# Altium schematic sheet Power.SchDoc: Eval Board - Power supply
size A3; Author: O. Guinnard; Organization: imperix Ltd; Address1: Rue de l'Industrie 10; Address2: 1950 Sion; Address3: Switzerland; Address4: +41 27 552 06 60; DocumentNumber: 1; SheetNumber: 1; SheetTotal: 7
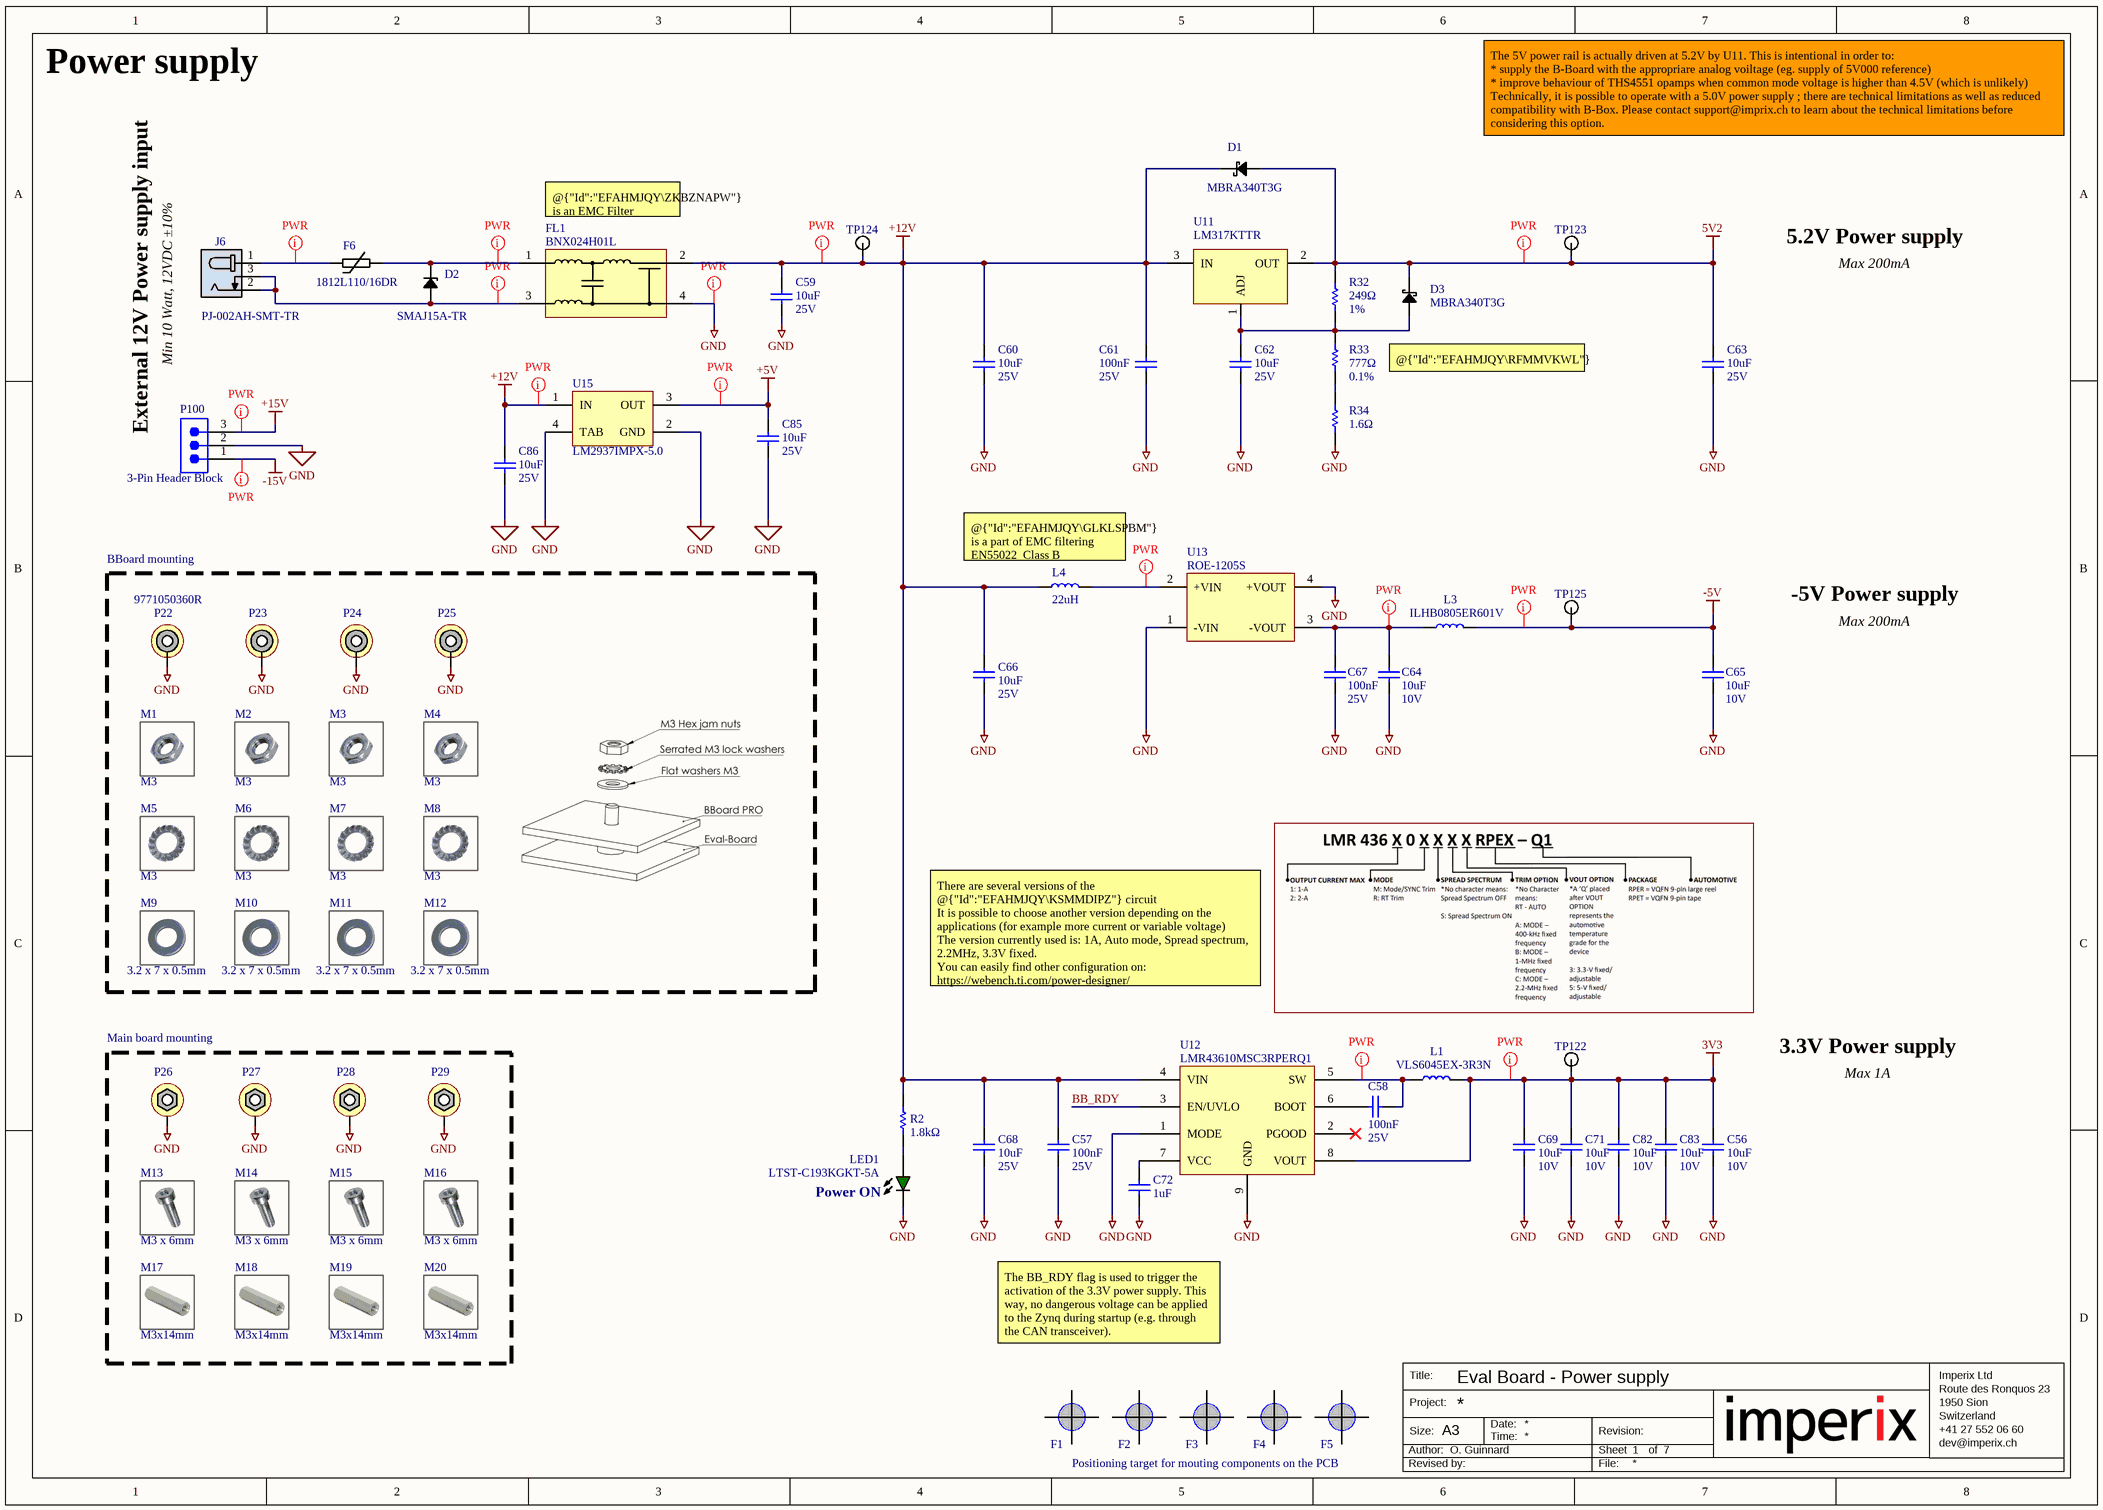
[diagram p0: Power.SchDoc]

## Parts
C56  value 10uF  Voltage Rating (DC): 10V  [CAPC1608L(0603)]  (hidden comment: CAP-10UF-10V-X5R-0603-10%)
C57  value 100nF  Voltage Rating (DC): 25V  [CAPC1005L(0402)]  (hidden comment: CAP-100NF-25V-X7R-0402-10%)
C58  value 100nF  Voltage Rating (DC): 25V  [CAPC1005L(0402)]  (hidden comment: CAP-100NF-25V-X7R-0402-10%)
C59  value 10uF  Voltage Rating (DC): 25V  [CAPC3216L(1206)]  (hidden comment: CAP-10UF-25V-X5R-1206-10%)
C60  value 10uF  Voltage Rating (DC): 25V  [CAPC3216L(1206)]  (hidden comment: CAP-10UF-25V-X5R-1206-10%)
C61  value 100nF  Voltage Rating (DC): 25V  [CAPC1005L(0402)]  (hidden comment: CAP-100NF-25V-X7R-0402-10%)
C62  value 10uF  Voltage Rating (DC): 25V  [CAPC3216L(1206)]  (hidden comment: CAP-10UF-25V-X5R-1206-10%)
C63  value 10uF  Voltage Rating (DC): 25V  [CAPC3216L(1206)]  (hidden comment: CAP-10UF-25V-X5R-1206-10%)
C64  value 10uF  Voltage Rating (DC): 10V  [CAPC1608L(0603)]  (hidden comment: CAP-10UF-10V-X5R-0603-10%)
C65  value 10uF  Voltage Rating (DC): 10V  [CAPC1608L(0603)]  (hidden comment: CAP-10UF-10V-X5R-0603-10%)
C66  value 10uF  Voltage Rating (DC): 25V  [CAPC3216L(1206)]  (hidden comment: CAP-10UF-25V-X5R-1206-10%)
C67  value 100nF  Voltage Rating (DC): 25V  [CAPC1005L(0402)]  (hidden comment: CAP-100NF-25V-X7R-0402-10%)
C68  value 10uF  Voltage Rating (DC): 25V  [CAPC3216L(1206)]  (hidden comment: CAP-10UF-25V-X5R-1206-10%)
C69  value 10uF  Voltage Rating (DC): 10V  [CAPC1608L(0603)]  (hidden comment: CAP-10UF-10V-X5R-0603-10%)
C71  value 10uF  Voltage Rating (DC): 10V  [CAPC1608L(0603)]  (hidden comment: CAP-10UF-10V-X5R-0603-10%)
C72  value 1uF  [CAPC1005L(0402)]  (hidden comment: CAP-1UF-6.3V-X5R-0402-5%)
C82  value 10uF  Voltage Rating (DC): 10V  [CAPC1608L(0603)]  (hidden comment: CAP-10UF-10V-X5R-0603-10%)
C83  value 10uF  Voltage Rating (DC): 10V  [CAPC1608L(0603)]  (hidden comment: CAP-10UF-10V-X5R-0603-10%)
C85  value 10uF  Voltage Rating (DC): 25V  [CAPC3216L(1206)]  (hidden comment: CAP-10UF-25V-X5R-1206-10%)
C86  value 10uF  Voltage Rating (DC): 25V  [CAPC3216L(1206)]  (hidden comment: CAP-10UF-25V-X5R-1206-10%)
D1  MBRA340T3G  [DO-214AC]
D2  SMAJ15A-TR  [DO-214AC]
D3  MBRA340T3G  [DO-214AC]
F1  Fiducial  [Fiducial050]  (value not drawn)  (no BOM)
F2  Fiducial  [Fiducial050]  (value not drawn)  (no BOM)
F3  Fiducial  [Fiducial050]  (value not drawn)  (no BOM)
F4  Fiducial  [Fiducial050]  (value not drawn)  (no BOM)
F5  Fiducial  [Fiducial050]  (value not drawn)  (no BOM)
F6  1812L110/16DR  [PTC Fuse(1812)]
FL1  BNX024H01L  [FP-BNX02-MFG]
J6  PJ-002AH-SMT-TR  [PJ-002AH-SMT-TR]
L1  VLS6045EX-3R3N  [VLS6045EX]
L3  ILHB0805ER601V  [RESC2012L(0805)]
L4  value 22uH  [Inductor 8400 Serie]  (hidden comment: 84223C)
LED1  LTST-C193KGKT-5A  [LED0603_GREEN]
M1  value M3  (hidden comment: 1090615)  (mechanical)
M2  value M3  (hidden comment: 1090615)  (mechanical)
M3  value M3  (hidden comment: 1090615)  (mechanical)
M4  value M3  (hidden comment: 1090615)  (mechanical)
M5  value M3  (hidden comment: 1278037)  (mechanical)
M6  value M3  (hidden comment: 1278037)  (mechanical)
M7  value M3  (hidden comment: 1278037)  (mechanical)
M8  value M3  (hidden comment: 1278037)  (mechanical)
M9  value 3.2 x 7 x 0.5mm  (hidden comment: 1887467)  (mechanical)
M10  value 3.2 x 7 x 0.5mm  (hidden comment: 1887467)  (mechanical)
M11  value 3.2 x 7 x 0.5mm  (hidden comment: 1887467)  (mechanical)
M12  value 3.2 x 7 x 0.5mm  (hidden comment: 1887467)  (mechanical)
M13  value M3 x 6mm  (hidden comment: 1145924)  (mechanical)
M14  value M3 x 6mm  (hidden comment: 1145924)  (mechanical)
M15  value M3 x 6mm  (hidden comment: 1145924)  (mechanical)
M16  value M3 x 6mm  (hidden comment: 1145924)  (mechanical)
M17  value M3x14mm  (hidden comment: 1382748)  (mechanical)
M18  value M3x14mm  (hidden comment: 1382748)  (mechanical)
M19  value M3x14mm  (hidden comment: 1382748)  (mechanical)
M20  value M3x14mm  (hidden comment: 1382748)  (mechanical)
P22  9771050360R  [9771050360R]
P23  9771050360R  [9771050360R]  (value not drawn)
P24  9771050360R  [9771050360R]  (value not drawn)
P25  9771050360R  [9771050360R]  (value not drawn)
P26  Spacer M3 connected  [Spacer M3 connected]  (value not drawn)  (no BOM)
P27  Spacer M3 connected  [Spacer M3 connected]  (value not drawn)  (no BOM)
P28  Spacer M3 connected  [Spacer M3 connected]  (value not drawn)  (no BOM)
P29  Spacer M3 connected  [Spacer M3 connected]  (value not drawn)  (no BOM)
P100  3-Pin Header Block  [691322310003]
R2  value 1.8kΩ  [RESC1608L(0603)]  (hidden comment: RES-1.8KΩ-1/8W-25PPM-0603-0.1%)
R32  value 249Ω  Tolerance: 1%  [RESC1005L(0402)]  (hidden comment: RES-249Ω-1/16W-100PPM-0402-1%)
R33  value 777Ω  Tolerance: 0.1%  [RESC1005L(0402)]  (hidden comment: RES-777Ω-1/16W-25PPM-0402-0.1%)
R34  value 1.6Ω  [RESC1005L(0402)]  (hidden comment: RES-1.6Ω-1/16WW-200PPM-0402-5%)
TP122  5001  [5001]  (value not drawn)
TP123  5001  [5001]  (value not drawn)
TP124  5001  [5001]  (value not drawn)
TP125  5001  [5001]  (value not drawn)
U11  LM317KTTR  [TO263-3]
U12  LMR43610MSC3RPERQ1  [LMR43610MSC3RPERQ1]
U13  ROE-1205S  [ROE]
U15  LM2937IMPX-5.0  [MP04A_M]

## Blocks framed on the sheet
BBoard mounting: M1-M12 P22-P25
Main board mounting: M13-M20 P26-P29

## Nets
3V3: C56.2 C69.2 C71.2 C82.2 C83.2 L1.2 TP122.1(TP) U12.8(VOUT)
5V2: C63.2 D1.A D3.K R32.2 TP123.1(TP) U11.2(OUT)
+5V: C85.2 U15.3(OUT)
+12V: C57.2 C59.2 C60.2 C61.2 C66.2 C68.2 C86.2 D1.K FL1.2(CB) L4.1 R2.2 TP124.1(TP) U11.3(IN) U12.4(VIN) U15.1(IN)
+15V: P100.3
-5V: C65.1 L3.2 TP125.1(TP)
-15V: P100.1
GND: C56.1 C57.1 C59.1 C60.1 C61.1 C62.1 C63.1 C64.2 C65.2 C66.1 C67.2 C68.1 C69.1 C71.1 C72.1 C82.1 C83.1 C85.1 C86.1 FL1.4(CG) LED1.K P22.0 P23.0 P24.0 P25.0 P26.1 P27.1 P28.1 P29.1 P100.2 R34.1 U12.1(MODE) U12.9(GND) U13.1(-VIN) U13.4(+VOUT) U15.2(GND) U15.4(TAB)
BB_RDY: U12.3(EN/UVLO)
NetC58_1: C58.1 L1.1 U12.5(SW)
NetC58_2: C58.2 U12.6(BOOT)
NetC62_2: C62.2 D3.A R32.1 R33.2 U11.1(ADJ)
NetC64_1: C64.1 C67.1 L3.1 U13.3(-VOUT)
NetC72_2: C72.2 U12.7(VCC)
NetD2_A: D2.A FL1.3(PSG) J6.2 J6.3
NetD2_K: D2.K F6.2 FL1.1(B)
NetF6_1: F6.1 J6.1
NetL4_2: L4.2 U13.2(+VIN)
NetLED1_A: LED1.A R2.1
NetR33_1: R33.1 R34.2

Not connected (* = marked no-connect by the designer): U12 2(PGOOD)*

## Layout directives
net class PWR: 3V3, 5V2, +5V, +12V, +15V, -5V, -15V, GND, NetC58_1, NetC64_1, NetD2_A, NetD2_K, NetF6_1, NetL4_2

## Notes on the sheet
- Power supply
- The 5V power rail is actually driven at 5.2V by U11. This is intentional in order to:
  * supply the B-Board with the appropriare analog voiltage (eg. supply of 5V000 reference)
  * improve behaviour of THS4551 opamps when common mode voltage is higher than 4.5V (which is unlikely)
  Technically, it is possible to operate with a 5.0V power supply ; there are technical limitations as well as reduced compatibility with B-Box. Please contact support@imprix.ch to learn about the technical limitations before considering this option.
- (near FL1) @{"Id":"EFAHMJQY\ZKBZNAPW"} is an EMC Filter
- 5.2V Power supply
- External 12V Power supply input
- Min 10 Watt, 12VDC ±10%
- Max 200mA
- @{"Id":"EFAHMJQY\RFMMVKWL"} helps reduce the noise of @{"Id":"EFAHMJQY\SLPSMMLY"}
- (near L4) @{"Id":"EFAHMJQY\GLKLSPBM"} is a part of EMC filtering
  EN55022  Class B
- -5V Power supply
- There are several versions of the @{"Id":"EFAHMJQY\KSMMDIPZ"} circuit
  It is possible to choose another version depending on the applications (for example more current or variable voltage)
  The version currently used is: 1A, Auto mode, Spread spectrum, 2.2MHz, 3.3V fixed.
  You can easily find other configuration on: https://webench.ti.com/power-designer/
- 3.3V Power supply
- Max 1A
- (near LED1) Power ON
- The BB_RDY flag is used to trigger the activation of the 3.3V power supply. This way, no dangerous voltage can be applied to the Zynq during startup (e.g. through the CAN transceiver).
- Positioning target for mouting components on the PCB
- Title:
- Imperix Ltd
- Route des Ronquos 23
- Author:
- Project:
- Size:
- A3
- Date:
- Time:
- Revision:
- Sheet
- of
- 1950 Sion
- Switzerland
- +41 27 552 06 60
- dev@imperix.ch
- Revised by:
- File:

## Library data of the parts
C56 C64 C65 C69 C71 C82 C83 = CMP-055-000003-7: CAP CER 10UF 10V X5R 0603 10% (Generic Imperix Component); Tolerance: 10%; Dielectric: X5R; Case/Package: 0603
C57 C58 C61 C67 = CMP-004-000006-18: CAP CER 100NF 25V X7R 0402 10% (Generic Imperix Component); Tolerance: 10%; Case/Package: 0402; Dielectric: X7R
C59 C60 C62 C63 C66 C68 C85 C86 = CMP-002-000022-5: CAP CER 10UF 25V X5R 1206 10% (Generic Imperix Component); Tolerance: 10%; Dielectric: X5R; Case/Package: 1206
  C86: Manufacturer: *
C72 = CMP-004-000008-13: CAP CER 1UF 6.3V X5R 0402 5% (Generic Imperix Component); Tolerance: 5%; Case/Package: 0402; Dielectric: X5R; Voltage Rating (DC): 6.3V
D1 D3 = CMP-005-000028-6: Diode Schottky 40 V 3A Surface Mount SMA; Max Forward Surge Current (Ifsm): 100A; Max Repetitive Reverse Voltage (Vrrm): 40V; Polarity: Standard; Element Configuration: Single; Forward Voltage: 450mV; Max Reverse Current: 300uA; Max Operating Temperature: 150°C; Radiation Hardening: No; Length: 4.32mm; Reach SVHC Compliant: No; Pins: 2; Package Quantity: 1; Voltage Rating (DC): 40V; RoHS Compliant: Yes; Halogen Free: Halogen Free; Series: -; Current Rating: 3A; Case/Package: DO-214AC; Height: 2mm; Min Operating Temperature: -55°C; Lead Free: Lead Free; Peak Non-Repetitive Surge Current: 100A; Max Reverse Voltage (DC): 40V; Output Current: 3A; Width: 2.6mm; Packaging: Tape and Reel; Forward Current: 3A; Average Rectified Current: 3A
D2 = CMP-030-000001-20: 32.5V Clamp 71A (8/20µs) Ipp Tvs Diode Surface Mount SMA (DO-214AC) Unidirectional; Voltage Rating (DC): 15V; Leakage Current: 200nA; Max Breakdown Voltage: 17.6V; Value: 975pF; Min Breakdown Voltage: 16.7V; Number of Elements: 1; Diode Type: ZENER; Power Line Protection: No; Power Dissipation: 400W; ESD Protection: Yes; Test Current: 1mA; Min Operating Temperature: -55°C; Height: 2.03mm; Max Reverse Leakage Current: 200nA; Breakdown Voltage: 17.6V; Max Operating Temperature: 150°C; Clamping Voltage-Max: 32.5V; Lead Free: Lead Free; Clamping Voltage: 32.5V; Polarity: Unidirectional; Reach SVHC Compliant: No; Width: 4.6mm; RoHS Compliant: Yes; Radiation Hardening: No; Case/Package: DO-214AC; Mounting Technology: Surface Mount; Direction: Unidirectional; Pins: 2; Package Quantity: 1; Peak Pulse Power: 400W; Series: SMAJ, TRANSIL™; Reverse Breakdown Voltage: 16.7V; Reverse Standoff Voltage: 15V; Operating Supply Voltage: 15V; Length: 2.95mm; Max Surge Current: 1mA; Packaging: Tape and Reel; Peak Pulse Current: 71A; Number of Unidirectional Channels: 1; Termination: SMD/SMT
F1-F5 = CMP-031-000000-13: Fiducial for pick&place (No BOM)
F6 = CMP-00170-3: PTC Resettable Fuse 1.1A(hold)  1.95A(trip) 16VDC 1812; Max Voltage Rating (DC): 16V; Approvals: cULus,TUV; Value: 180mR; Max Power Dissipation: 800mW; Max Current Rating: 100A; Time to Trip: 300ms; Hold Current: 1.1A; Width: 4.73mm; Max Operating Temperature: 85°C; Trip Current: 1.95A; Case Code (Metric): 4532; Mounting Technology: Surface Mount; Packaging: Tape and Reel; Case Code (Imperial): 1812; RoHS Compliant: Yes; Case/Package: 1812; Series: 1812L; Power Dissipation: 800mW; Package Quantity: 1500; Current Rating: 100A; Lead Free: Lead Free; Termination: SMD/SMT; Operating Supply Voltage: 16V; Min Operating Temperature: -40°C; Voltage Rating (DC): 16V; Reach SVHC Compliant: Unknown; Working Voltage: 16V
FL1 = CMP-00068-6: EMI Filter Block 15A 50VDC Flat Style SMD Automotive Embossed T/R
J6 = CMP-056-000006-11: 2.0 x 6.5 mm, 5.0 A, Horizontal, Surface Mount (SMT), Dc Power Jack Connector; Body Color: Black; Gender: Male; Shielding: Unshielded; Connector Type: Jack; Contact Material: Brass; Contact Plating: Nickel; Flammability Rating: UL94 V-0; Housing Material: Nylon; Max Operating Temperature: 85°C; Min Operating Temperature: -25°C; Mounting Technology: Surface Mount; Termination: Solder
L1 = CMP-259-000003-2: Inductor Power Shielded Wirewound 3.3uH 30% 100KHz Ferrite 4.95A 0.0299Ohm DCR 2424 T/R; DC Resistance (DCR): 30mR; Saturation Current: 6.5A; Shielding: Shielded; Mounting Technology: Surface Mount; Core Material: Ferrite; Length: 0.236inch; Current Rating: 4.95A; Test Frequency: 100kHz; Height - Seated (Max): 0.177inch; Inductance Tolerance: 30%; RMS Current (Irms): 4.95A; Reach SVHC Compliant: No; Tolerance: 30%; Case/Package: Nonstandard; Width: 0.236inch; RoHS Compliant: Yes; Packaging: Cut Tape; Value: 3.3uH; Series: VLS-EX; Max Operating Temperature: 105°C; Min Operating Temperature: -40°C
L3 = CMP-007-000004-5: Ferrite Beads Multi-Layer High Current 600Ohm 25% 100MHz 2A 100mOhm DCR 0805 T/R; DC Resistance (DCR): 100mR; Impedance: 600R; Number of Lines: 1; Shielding: Shielded; Value: 600Ω 2A; Case/Package: 0805; Case Code (Imperial): 0805; Case Code (Metric): 2012; Core Material: Ferrite; Current Rating: 2A; DC Current: 2A; Depth: 1.45mm; Height: 0.043inch; Lead Free: Lead Free; Length: 0.079inch; Max Current Rating: 2A; Max DC Current: 2A; Max Operating Temperature: 125°C; Military Standard: Not; Min Operating Temperature: -55°C; Mounting Technology: Surface Mount; Package Quantity: 4000; Packaging: Tape and Reel; Pins: 2; Radiation Hardening: No; Reach SVHC Compliant: Unknown; RoHS Compliant: Yes; Self Resonant Frequency: 100MHz; Series: ILHB; Termination: SMD/SMT; Test Frequency: 100MHz; Tolerance: 25%; Width: 1.25mm
L4 = CMP-00092-4: Inductor Power Wirewound 22uH 10% 0.6A 0.6Ohm DCR 1812; Shielding: Unshielded; DC Resistance (DCR): 600mR; Max DC Current: 600mA; Min Operating Temperature: -40°C; Depth: 3.6mm; Termination: SMD/SMT; Packaging: Tape and Reel; Case/Package: Nonstandard; Max Operating Temperature: 125°C; Width: 3.3mm; Length: 4.5mm; Height: 2.6mm; Series: 8400; Mounting Technology: Surface Mount; RoHS Compliant: Yes; Tolerance: 10%; Radiation Hardening: No
LED1 = CMP-030-000000-10: LED GREEN CLEAR 0603 SMD; Lens Size: 0.8mm; Lens Color: Colorless; Illumination Color: Green,Yellow; Dominant Wavelength: 576.5nm; Test Current: 5mA; Luminous Intensity: 28mcd; Power Dissipation: 75mW; Lens Style: Flat,Diffused,Colorless,Rectangular,Clear; Forward Voltage: 2.3V; Reverse Voltage: 5V; Viewing Angle: 130°; Number of Elements: 1; Forward Current: 30mA; Radiation Hardening: No; RoHS Compliant: Yes; Series: -; Case/Package: 0603; Depth: 0.8mm; Min Operating Temperature: -55°C; Height: 0.45mm; Mounting Technology: Surface Mount; Lens Transparency: Clear; Case Code (Metric): 1608; Pins: 2; Lead Free: Lead Free; Color: Green; Power Rating: 75mW; Packaging: Tape and Reel; Case Code (Imperial): 0603; Package Quantity: 3000; Max Operating Temperature: 85°C; Length: 1.6mm; Number of LEDs: 1; Width: 0.8mm
M1-M4 = CMP-00174-1: M3 Hex jam nuts; Thread size: M3; Thickness: 1.8mm
M5-M8 = CMP-00031-5: Serrated M3 lock washers type A, external serrations
M9-M12 = CMP-00030-4: Flat washers M3 without chamfer
M13-M16 = CMP-00026-4: Hexalobular (6 Lobe) socket head cap M3x6mm screws with low head, fully threaded; Thread size: M3; Length: 6mm
M17-M20 = CMP-00173-1: Brass Spacer M3x14mm  Metric Thread int./int.; Plating: Nickel; Gender: Female, Female; Threaded/Unthreaded: Threaded; Color: Silver; Material: Brass
P22-P25 = CMP-002-000068-13: WA-SMSE SMT Steel Spacer, M3x5mm Thread External; Thread Size: M3; Threaded/Unthreaded: Threaded; Outside Diameter: 0.236inch; Plating: Tin; Body Length: 5mm; Mounting Technology: External; Length: 0.433inch; Material: Steel; Series: WA-SMSE; Reach SVHC Compliant: Unknown; Width: 6mm
P26-P29 = CMP-00128-10: Hole and pad for spacer M3; Outside diameter SW: 5.5mm; Thread Size: M3
P100 = CMP-1502-01887-2: TERM BLOCK HDR 3POS 90DEG 3.81MM; NexarPartId: 8917778; Manufacturer: Würth; Number of Positions Per Level: 3; Current: 10A; Voltage: 300V; Number of Levels: 1; Gender: Male; Termination: Solder; Number of Rows: 1; Contact Plating: Tin; Packaging: Box; Height: 9.2mm; Pitch: 3.81mm; Mount: Through Hole; Number of Contacts: 3; Width: 12.82mm; Lead Pitch: 3.81mm; REACH SVHC: Unknown; RoHS: Compliant; Length: 10.5mm; Number of Pins: 3; Color: Green; Contact Material: Brass; Manufacturer Part Number: 691322310003; Distributor Link: https://www.digikey.de/de/products/detail/w%C3%BCrth-elektronik/691322310003/2060585
R2 = CMP-00098-1: RES SMD 1.8KΩ 1/8W 25PPM 0603 0.1% (Generic Imperix Component); Temperature Coefficient: 25ppm/°C; Tolerance: 0.1%; Power Rating: 1/8W; Case/Package: 0603
R32 = CMP-132-000003-2: RES SMD 249Ω 1/16W 100PPM 0402 1% (Generic Imperix Component); Temperature Coefficient: 100ppm/°C; Power Rating: 1/16W; Case/Package: 0402
R33 = CMP-150-000004-2: RES SMD 777Ω 1/16W 25PPM 0402 0.1% (Generic Imperix Component); Temperature Coefficient: 25ppm/°C; Power Rating: 1/16W; Case/Package: 0402
R34 = CMP-004-000018-3: RES SMD 1.6Ω 1/16WW 200PPM 0402 5% (Generic Imperix Component); Temperature Coefficient: 200ppm/°C; Power Rating: 1/16W; Tolerance: 5%; Case/Package: 0402
TP122-TP125 = CMP-049-000000-14: Black PC Test Point, Miniature Phosphor Bronze Silver Plating Through Hole Mounting Type; Inside Diameter: 1.27mm; Hole Diameter: 1.6mm; Outside Diameter: 2.54mm; Number of Contacts: 1; Insulation: Insulated; Contact Material: Bronze; Material: Nylon,Bronze,Silver; Mounting Technology: Through Hole; Series: THM; Reach SVHC Compliant: No; Length: 7.62mm; Body Material: Bronze; Lead Free: Lead Free; Packaging: Bulk; Package Quantity: 100; Contact Plating: Tin,Silver; Color: Black; RoHS Compliant: Yes; Insulation Material: Nylon; Housing Color: Black; Orientation: Straight; Diameter: 2.54mm; Termination: Through Hole; Number of Ports: 1; Plating: Silver
U11 = CMP-011-000003-10: IC REG LINEAR ADJ 1.5A DDPAK; Number of Regulators: 1; Dropout Voltage: 2V; Polarity: Positive; Output Type: Adjustable; Quiescent Current: 3.5mA; Max Supply Voltage: 40V; Power Supply Rejection Ratio (PSRR): 64dB; Min Output Voltage: 1.25V; Reference Voltage: 1.3V; Output Voltage: 37V; Min Input Voltage: 4.2V; Length: 10.18mm; Pins: 3; Output Current: 1.5A; Max Operating Temperature: 125°C; Package Quantity: 1; Mounting Technology: Surface Mount; Packaging: Tape and Reel; Series: LM317; Min Operating Temperature: 0°C; Reach SVHC Compliant: No; Max Output current: 1.5A; Weight: 0.050897oz; Number of Outputs: 1; Width: 8.41mm; Lead Free: Lead Free; Case/Package: TO263-3; Max Output Voltage: 37V; Height: 4.44mm; RoHS Compliant: Yes
U12 = CMP-00162-5: LMR436x0, 36-V, 1-A Buck Converter
U13 = CMP-004-000025-11: Isolated Module DC DC Converter 1 Output 5V 200mA 10.8V - 13.2V Input; Isolation Voltage: 1kV; Efficiency: 80%; Number of Outputs: 1; Max Power Dissipation: 1W; Max Output current: 200mA; Series: ECONOLINE ROE (E-Series) (1W); RoHS Compliant: Yes; Max Operating Temperature: 85°C; Packaging: Rail/Tube; Voltage - Output 1: 5V; Min Input Voltage: 10.8V; Length: 11.5mm; Max Output Voltage: 5V; Min Operating Temperature: -40°C; Max Supply Voltage: 13.2V; Width: 6mm; Height: 10mm; Mounting Technology: Through Hole; Lead Free: Lead Free; Weight: 1.4g
U15 = CMP-001-0000-1: IC REG LINEAR 5V 400MA SOT223-4